# EAGLE design msp430_pogo (EAGLE 6.5.0)
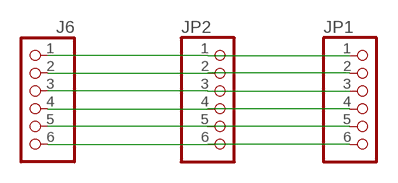
[diagram p0: schematic, sheet 1]

## Parts
J6  PH1X650MIL  [PH1X6_50MIL]
JP1  PINHD-1X6  [1X06]
JP2  PINHD-1X6  [1X06]

## Nets
N$1: J6.1 JP1.1 JP2.1
N$2: J6.2 JP1.2 JP2.2
N$3: J6.3 JP1.3 JP2.3
N$4: J6.4 JP1.4 JP2.4
N$5: J6.5 JP1.5 JP2.5
N$6: J6.6 JP1.6 JP2.6

## Library data of the parts
J6 = MY_CONN:PH1X6
JP1 JP2 = pinhead:PINHD-1X6: PIN HEADER

## Board
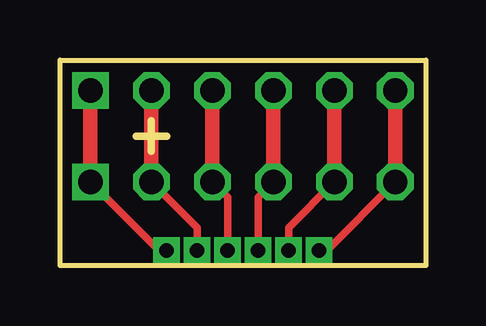
[diagram p1: board, top side]

Size 15.24 x 8.57 mm. Coordinates in mm from the lower left corner, seen from the top.
Outline: 4.45,5.4 3.18,5.4
Outline: 3.81,6.03 3.81,4.76
Outline: 15.24,0 0,0 0,8.57 15.24,8.57 15.24,0
Copper layers (1*16): Top 0.035mm / dielectric 1.5mm / Bottom 0.035mm
Design rules "default": minimum track width 10mil, minimum drill 24mil, track to track 8mil, track to pad 8mil, pad to pad 8mil, via to via 8mil, smd to smd 8mil, copper to edge 40mil, drill to drill 8mil, minimum pad ring 10mil, minimum via ring 8mil, stop-mask expansion 4mil, vias tented up to drill 0mil, thermal gap 10mil

### Footprints (pad centres in the part's own frame; a part is rotated, then mirrored left to right if it is on the bottom)
PH1X6_50MIL = drill 0.6 pad 0.889 square: 1 0,0; 2 0,-1.27; 3 0,-2.54; 4 0,-3.81; 5 0,-5.08; 6 0,-6.35
1X06 = drill 1.016 square: 1 -6.35,0 | drill 1.016 octagon: 2 -3.81,0; 3 -1.27,0; 4 1.27,0; 5 3.81,0; 6 6.35,0

### Placement (x,y rotation side)
J6  4.45,0.64 90 top
JP1  7.62,7.3 0 top
JP2  7.62,3.49 0 top

### Tracks (layer width: path | path; a pad name or v marks a point on that pad's centre or on a via)
N$1
  Top 0.305: JP2.1 4.13,0.64 J6.1
  Top 0.61: JP2.1 JP1.1
N$2
  Top 0.305: JP2.2 5.71,1.59 J6.2
  Top 0.61: JP2.2 JP1.2
N$3
  Top 0.305: JP2.3 6.99,2.86 J6.3
  Top 0.61: JP2.3 JP1.3
N$4
  Top 0.305: JP2.4 8.26,2.86 J6.4
  Top 0.61: JP2.4 JP1.4
N$5
  Top 0.305: JP2.5 9.53,1.59 J6.5
  Top 0.61: JP1.5 JP2.5
N$6
  Top 0.305: JP2.6 11.11,0.64 J6.6
  Top 0.61: JP1.6 JP2.6